# Altium schematic sheet Deadtime_logic.SchDoc: Dead time & interlock
size A4; CheckedBy: Hildo / Joel / Luis; Author: Fellipe; Organization: UNICAMP / LCEE; Address1: University of Campinas - Brazil; Address2: Power Conditioning Laboratory; Address3: Licensed by GNU GPL 3.0; ProjectName: Easy Inverter
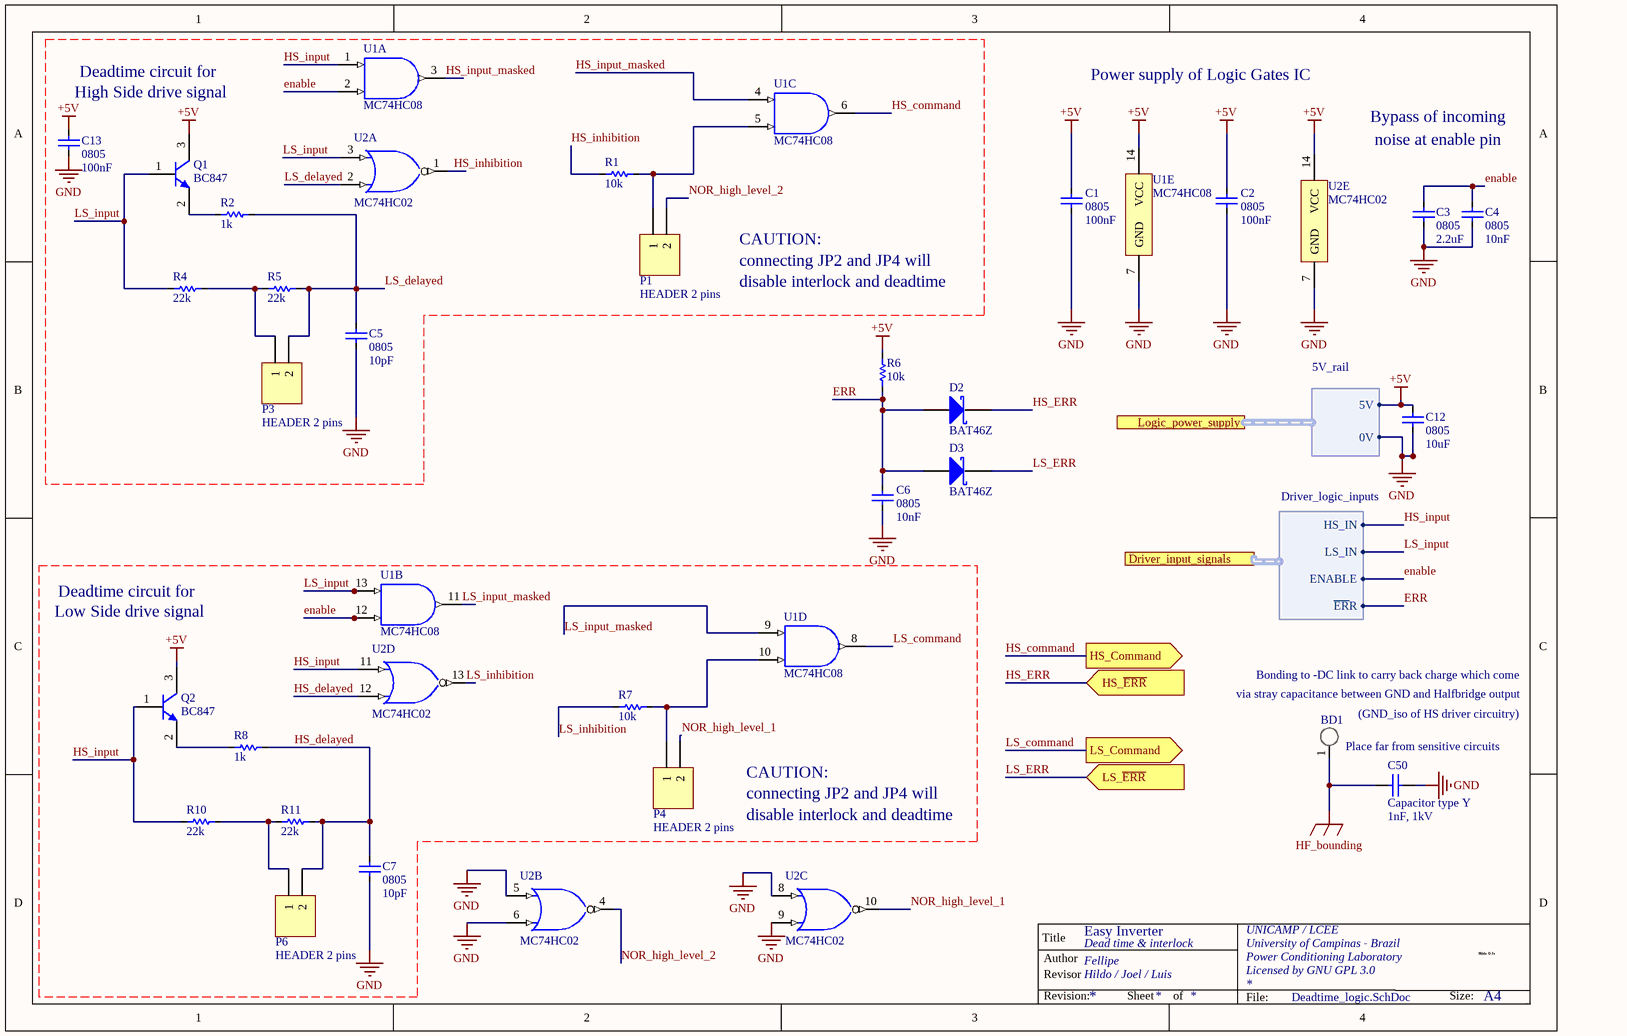
[diagram p0: Deadtime_logic.SchDoc]

## Parts
BD1  Place far from sensitive circuits  [Bonding_pad]
C1  0805  value 100nF  [Capacitor 0805]
C2  0805  value 100nF  [Capacitor 0805]
C3  0805  value 2.2uF  [Capacitor 0805]
C4  0805  value 10nF  [Capacitor 0805]
C5  0805  value 10pF  [Capacitor 0805]
C6  0805  value 10nF  [Capacitor 0805]
C7  0805  value 10pF  [Capacitor 0805]
C12  0805  value 10uF  [Capacitor 0805]
C13  0805  value 100nF  [Capacitor 0805]
C50  Capacitor type Y  value 1nF, 1kV  [CAPACITOR 1812]
D2  BAT46Z  [SOD 123]
D3  BAT46Z  [SOD 123]
P1  HEADER 2 pins  [HDR1X2 - Jumper]
P3  HEADER 2 pins  [HDR1X2 - Jumper]
P4  HEADER 2 pins  [HDR1X2 - Jumper]
P6  HEADER 2 pins  [HDR1X2 - Jumper]
Q1  BC847  [SOT 23]
Q2  BC847  [SOT 23]
R1  value 10k  [Resistor 0805]  (hidden comment: Resistor 0805)
R2  value 1k  [Resistor 0805]  (hidden comment: Resistor 0805)
R4  value 22k  [Resistor 0805]  (hidden comment: Resistor 0805)
R5  value 22k  [Resistor 0805]  (hidden comment: Resistor 0805)
R6  value 10k  [Resistor 0805]  (hidden comment: Resistor 0805)
R7  value 10k  [Resistor 0805]  (hidden comment: Resistor 0805)
R8  value 1k  [Resistor 0805]  (hidden comment: Resistor 0805)
R10  value 22k  [Resistor 0805]  (hidden comment: Resistor 0805)
R11  value 22k  [Resistor 0805]  (hidden comment: Resistor 0805)
U1  value MC74HC08  [SOIC 14]  (hidden comment: MC74HC08ADG)  (parts A,B,C,D,E of 5)
U2  value MC74HC02  [SOIC 14]  (hidden comment: MC74HC02ADG)  (parts A,B,C,D,E of 5)

## Ports
Driver_input_signals (harness Driver_logic_inputs), HS_Command (out), HS_~{ERR} (in), Logic_power_supply (harness 5V_rail), LS_Command (out), LS_~{ERR} (in)

## Harnesses
Driver_logic_inputs: HS_IN, LS_IN, ENABLE, ~{ER}R
5V_rail: 0V, 5V

## Nets
+5V: C1.1 C2.1 C12.1 C13.1 Q1.3(C) Q2.3(C) R6.2 U1.14(VCC) U2.14(VCC) ; port Logic_power_supply.5V
GND: C1.2 C2.2 C3.2 C4.2 C5.2 C6.2 C7.2 C12.2 C13.2 C50.2 U1.7(GND) U2.5(2A) U2.6(2B) U2.7(GND) U2.8(3A) U2.9(3B) ; port Logic_power_supply.0V
HF_bounding: BD1.1 C50.1
enable: C3.1 C4.1 U1.2(1B) U1.12(4A) ; port Driver_input_signals.ENABLE
ERR: C6.1 D2.1(A) D3.1(A) R6.1 ; port Driver_input_signals.~{ER}R
HS_command: U1.6(2Y) ; port HS_Command
HS_delayed: C7.1 P6.2 R8.2 R11.2 U2.12(4B)
HS_ERR: D2.2(K) ; port HS_~{ERR}
HS_inhibition: R1.1 U2.1(1Y)
HS_input: Q2.1(B) R10.1 U1.1(1A) U2.11(4A) ; port Driver_input_signals.HS_IN
HS_input_masked: U1.3(1Y) U1.4(2A)
LS_command: U1.8(3Y) ; port LS_Command
LS_delayed: C5.1 P3.2 R2.2 R5.2 U2.2(1A)
LS_ERR: D3.2(K) ; port LS_~{ERR}
LS_inhibition: R7.1 U2.13(4Y)
LS_input: Q1.1(B) R4.1 U1.13(4B) U2.3(1B) ; port Driver_input_signals.LS_IN
LS_input_masked: U1.9(3A) U1.11(4Y)
NOR_high_level_1: P4.2 U2.10(3Y)
NOR_high_level_2: P1.2 U2.4(2Y)
NetP1_1: P1.1 R1.2 U1.5(2B)
NetP3_1: P3.1 R4.2 R5.1
NetP4_1: P4.1 R7.2 U1.10(3B)
NetP6_1: P6.1 R10.2 R11.1
NetQ1_2: Q1.2(E) R2.1
NetQ2_2: Q2.2(E) R8.1

## Notes on the sheet
- (near C13) High Side drive signal
- Deadtime circuit for
- Power supply of Logic Gates IC
- Bypass of incoming
- noise at enable pin
- CAUTION:
- connecting JP2 and JP4 will
- disable interlock and deadtime
- Low Side drive signal
- (near BD1) via stray capacitance between GND and Halfbridge output
- Bonding to -DC link to carry back charge which come
- (near BD1) (GND_iso of HS driver circuitry)
- Title
- Author
- Revisor
- Hildo G Jr
- Revision:
- Sheet
- of
- File:
- Size:
- A4
- HGJr

## Library data of the parts
BD1 = Bonding_pad: Used to connect carry the currents  from the GND logic plane back to the -DC_link plane, which is originated by parasitic capacitive coupling between Halfbridge output and GND plane; value: none; pn: none
C1-C7 C12 C13 = Capacitor 0805: SMD ceramic capacitor 0805; pn: undefined
C50 = Y Capacitor: High Voltage Capacitor to filter EMC from heatsink; pn: C1210C104KBRAC7800, C1812C104KDRAC7800
D2 D3 = BAT46Z: DIODE SCHOTTKY 100V 150MA SOD123; pn: BAT46ZFILM; Value: BAT46Z
P1 = HEADER 2 pins: Header 2.54mm 2 pins; Jumper_text: Close to disable HS deadtime; PN: ?; Pin_1_signal: *; Pin_2_signal: *
P3 P6 = HEADER 2 pins: Header 2.54mm 2 pins; PN: ?; Pin_1_signal: *; Pin_2_signal: *
P4 = HEADER 2 pins: Header 2.54mm 2 pins; Jumper_text: Close to disable LS deadtime; PN: ?; Pin_1_signal: *; Pin_2_signal: *
Q1 Q2 = BC847BLT1G: General Purpose Transistor, NPN Silicon, 3-Pin SOT-23, Pb-Free, Tape and Reel; PN: BC847BLT1G; Value: BC847
R1 R2 R4-R8 R10 R11 = Resistor 0805: SMD resistor 0805; pn: undefined
U1 = MC74HC08ADG: Quadruple 2-Input Positive-AND Gates; ComponentLink2Description: Datasheet; ComponentLink2URL: http://www.ti.com/lit/ds/symlink/sn74hc08.pdf; PN: MC74HC08ADG
U2 = MC74HC02ADG: Logic Quad 2-Input NOR Gates; PN: MC74HC02ADG; ComponentLink2Description: Datasheet; ComponentLink2URL: http://www.ti.com/lit/ds/symlink/cd74hc02.pdf